# EAGLE design espIntrepid (EAGLE 9.6.2)
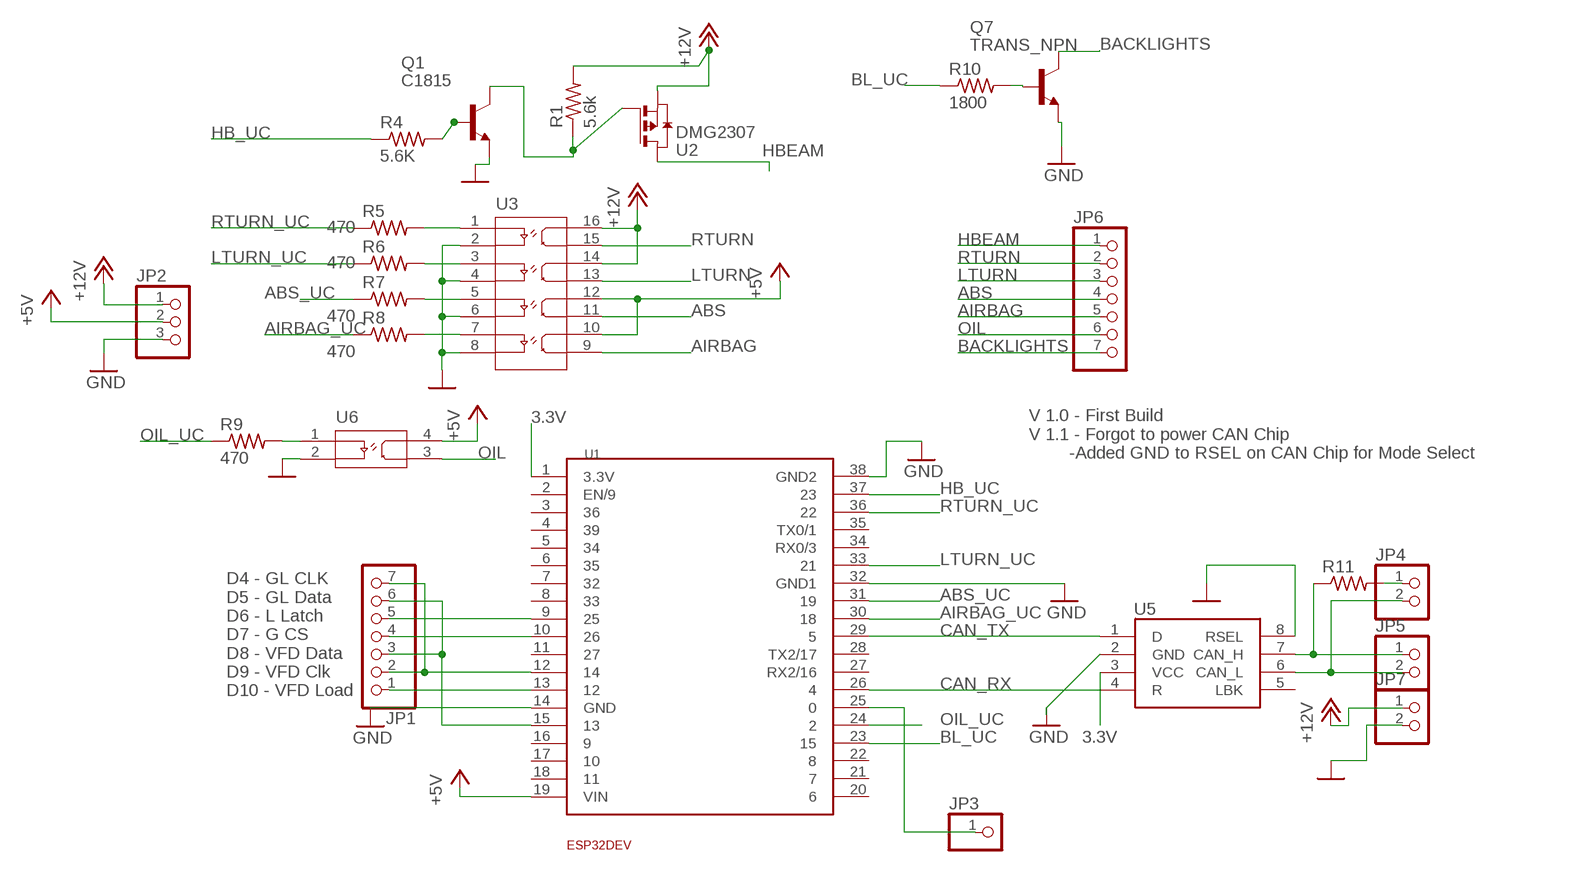
[diagram p0: schematic, sheet 1]

## Parts
JP1  PINHD-1X7  [1X07]
JP2  PINHD-1X3  [1X03]
JP3  PINHD-1X1  [1X01]
JP4  PINHD-1X2  [1X02]
JP5  PINHD-1X2  [1X02]
JP6  PINHD-1X7  [1X07]
JP7  PINHD-1X2  [1X02]
Q1  C1815  TRANS_NPN  [SOT-23]
Q7  TRANS_NPN  [SOT-23]
R1  5.6k  R-US_M1206  [M1206]
R4  5.6K  R-US_M1206  [M1206]
R5  470  R-US_M1206  [M1206]
R6  470  R-US_M1206  [M1206]
R7  470  R-US_M1206  [M1206]
R8  470  R-US_M1206  [M1206]
R9  470  R-US_M1206  [M1206]
R10  1800  R-US_M1206  [M1206]
R11  R-US_M1206  [M1206]
U1  ESP32DEV_38  [ESP32DEV_38]
U2  DMG2307  MOSFET_P  [SOT-23]
U3  LTV-847  [SM-16]
U5  SN65HVD233D  [SOIC-8]
U6  LTV-817  [SM-4]

## Nets
3.3V: U1.1(3.3V) U5.3(VCC)
+5V: JP2.2 U1.19(VIN) U3.10 U3.12 U6.4
+12V: JP2.1 JP7.1 R1.2 U2.2(S) U3.14 U3.16
ABS: JP6.4 U3.11
ABS_UC: R7.1 U1.31
AIRBAG: JP6.5 U3.9
AIRBAG_UC: R8.1 U1.30
BACKLIGHTS: JP6.7 Q7.3(C)
BL_UC: R10.1 U1.23
CAN_RX: U1.26 U5.4(R)
CAN_TX: U1.29 U5.1(D)
GND: JP2.3 JP7.2 Q1.2(E) Q7.2(E) U1.14(GND) U1.32(GND1) U1.38(GND2) U3.2 U3.4 U3.6 U3.8 U5.2(GND) U5.8(RSEL) U6.2
HB_UC: R4.1 U1.37
HBEAM: JP6.1 U2.3(D)
LTURN: JP6.3 U3.13
LTURN_UC: R6.1 U1.33
N$1: Q7.1(B) R10.2
N$2: R5.2 U3.1
N$3: JP5.1 R11.1 U5.7(CAN_H)
N$4: JP1.5 U1.9
N$5: JP1.4 U1.10
N$6: JP1.1 U1.13
N$7: JP1.3 JP1.6 U1.15
N$8: JP1.2 JP1.7 U1.12
N$11: R8.2 U3.7
N$12: Q1.1(B) R4.2
N$13: Q1.3(C) R1.1 U2.1(G)
N$14: R6.2 U3.3
N$15: R7.2 U3.5
N$16: R9.2 U6.1
N$17: JP3.1 U1.25
N$19: JP4.2 JP5.2 U5.6(CAN_L)
N$21: JP4.1 R11.2
OIL: JP6.6 U6.3
OIL_UC: R9.1 U1.24
RTURN: JP6.2 U3.15
RTURN_UC: R5.1 U1.36
Unconnected: U1.2(EN/9) U1.3 U1.4 U1.5 U1.6 U1.7 U1.8 U1.11 U1.16 U1.17 U1.18 U1.20 U1.21 U1.22 U1.27(RX2/16) U1.28(TX2/17) U1.34(RX0/3) U1.35(TX0/1) U5.5(LBK)

## Notes on the sheet
- V 1.0 - First Build
  V 1.1 - Forgot to power CAN Chip
          -Added GND to RSEL on CAN Chip for Mode Select
- D4 - GL CLK
  D5 - GL Data
  D6 - L Latch
  D7 - G CS
  D8 - VFD Data
  D9 - VFD Clk
  D10 - VFD Load

## Library data of the parts
JP1 JP6 = pinhead:PINHD-1X7: PIN HEADER
JP2 = pinhead:PINHD-1X3: PIN HEADER
JP3 = pinhead:PINHD-1X1: PIN HEADER
JP4 JP5 JP7 = pinhead:PINHD-1X2: PIN HEADER
Q1 Q7 = DR:TRANS_NPN: Transistor, NPN
R1 R4-R11 = DR:R-US_: RESISTOR, American symbol
U1 = DR:ESP32DEV_38
U2 = DR:MOSFET_P
U3 = DR:LTV-847: OptoIsolator
U5 = DR:SN65HVD233D: CAN Transceiver with loopback and mode sel
U6 = DR:LTV-817: Single OptoIsolator

## Board
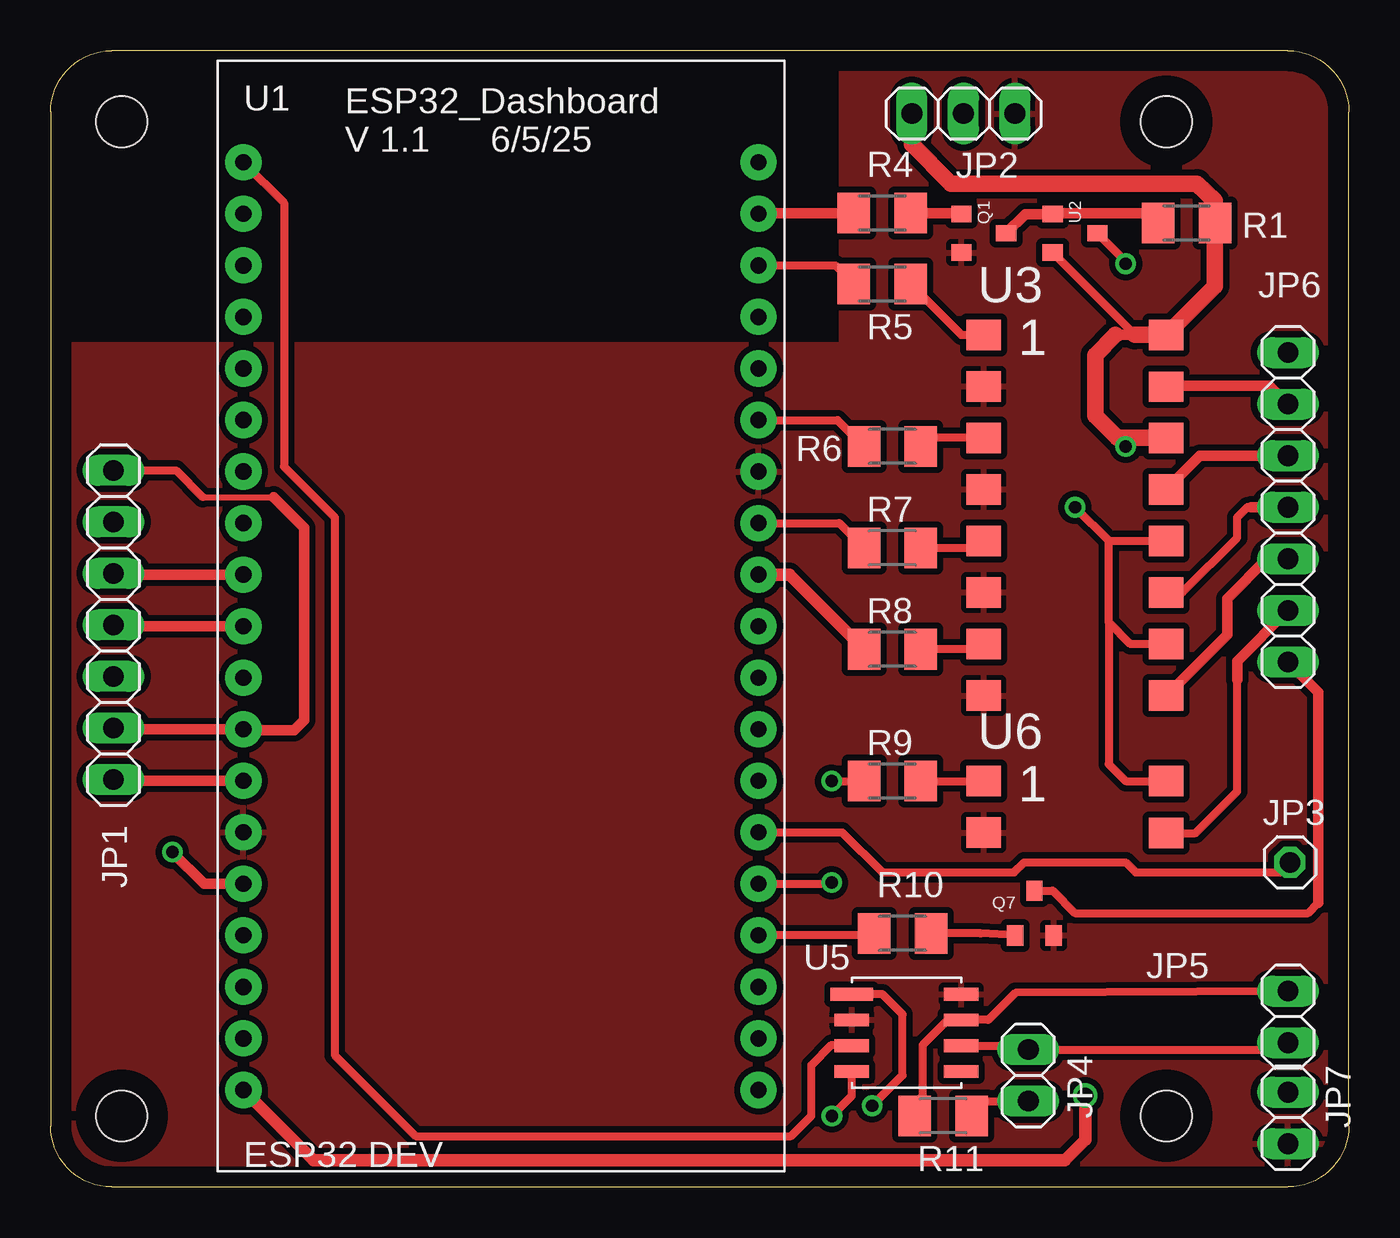
[diagram p1: board, top side]
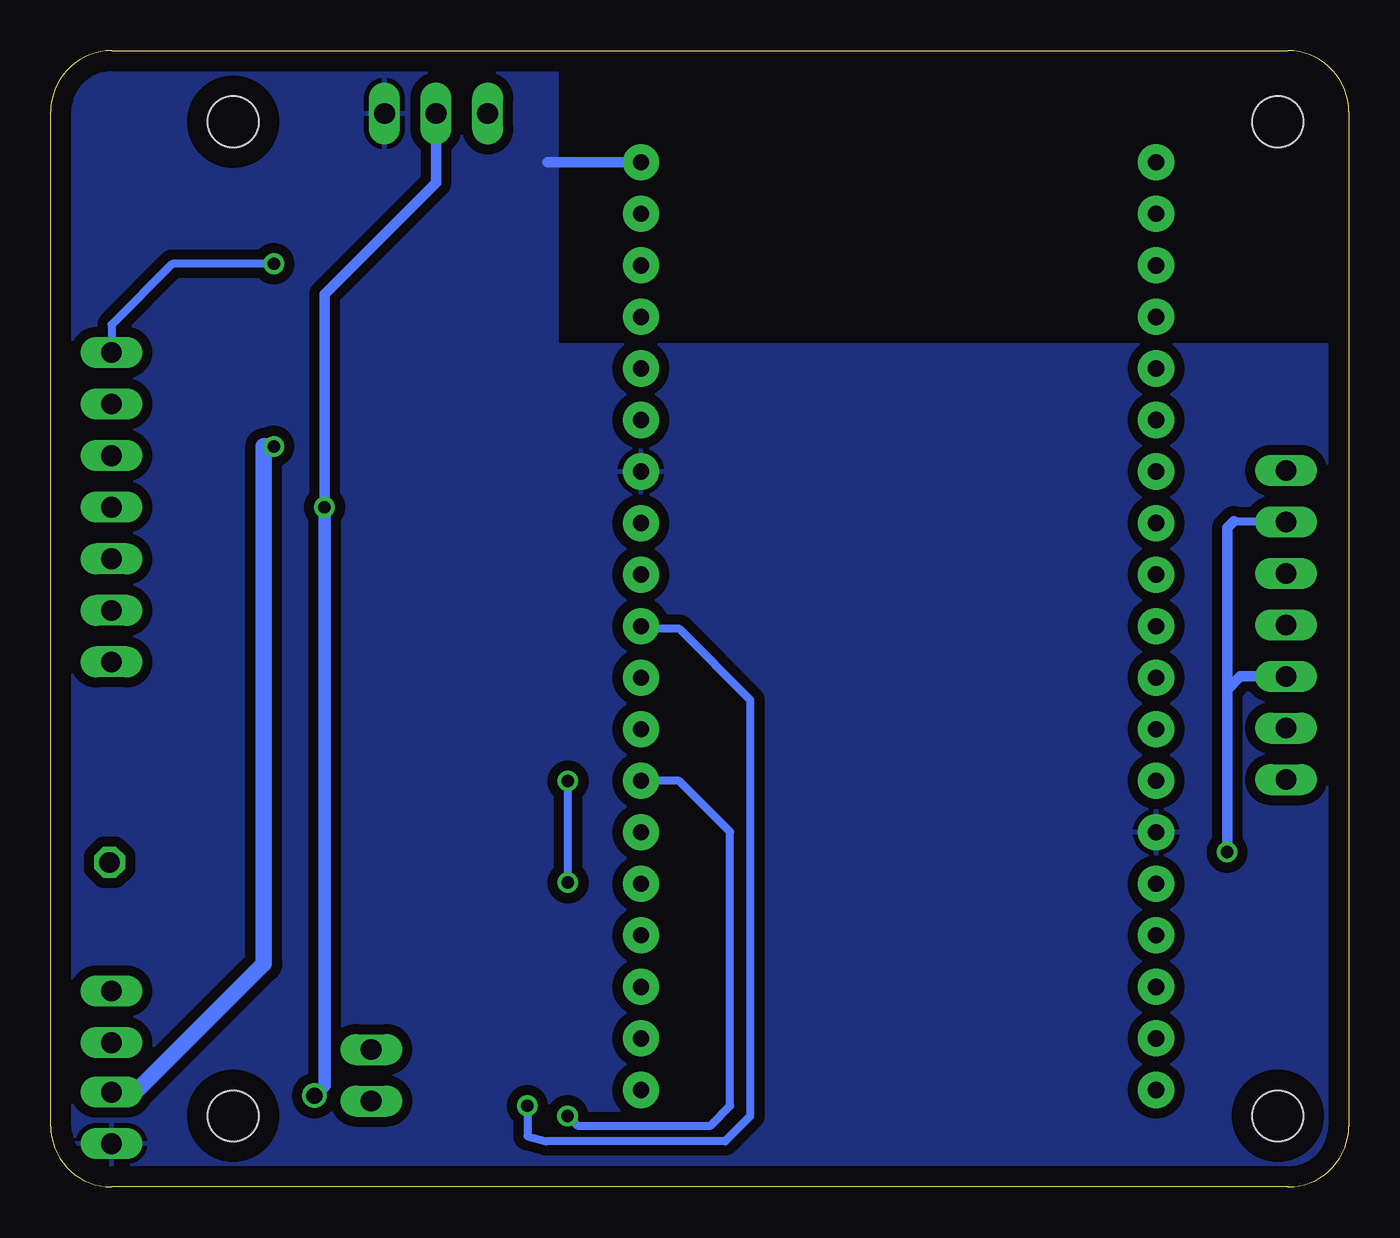
[diagram p2: board, bottom side, seen from below]

Size 64 x 56 mm. Coordinates in mm from the lower left corner, seen from the top.
Outline: 3,0 61,0 arc90 64,3 64,53 arc90 61,56 3,56 arc90 0,53 0,3 arc90 3,0
Copper layers (1*16): Top 0.035mm / dielectric 1.5mm / Bottom 0.035mm
Design rules "default": minimum track width 10mil, minimum drill 24mil, track to track 8mil, track to pad 8mil, pad to pad 8mil, via to via 8mil, smd to smd 8mil, copper to edge 40mil, drill to drill 8mil, minimum pad ring 10mil, minimum via ring 8mil, stop-mask expansion 4mil, vias tented up to drill 0mil, thermal gap 10mil
Holes 2.5 mm at 3.5,3.5 3.5,52.5 55,3.5 55,52.5

### Footprints (pad centres in the part's own frame; a part is rotated, then mirrored left to right if it is on the bottom)
1X07 = drill 1.016 long: 1 -7.62,0; 2 -5.08,0; 3 -2.54,0; 4 0,0; 5 2.54,0; 6 5.08,0; 7 7.62,0
1X03 = drill 1.016 long: 1 -2.54,0; 2 0,0; 3 2.54,0
1X01 = drill 1.016 octagon: 1 0,0
1X02 = drill 1.016 long: 1 -1.27,0; 2 1.27,0
SOT-23 = smd 0.8 x 1: 1 -0.95,-2.1; 2 0.95,-2.1; 3 0,0.1
M1206 = smd 1.6 x 2: 1 -1.4,0; 2 1.4,0
ESP32DEV_38 = drill 0.8 pad 1.778: 1 0,0; 2 0,-2.54; 3 0,-5.08; 4 0,-7.62; 5 0,-10.16; 6 0,-12.7; 7 0,-15.24; 8 0,-17.78; 9 0,-20.32; 10 0,-22.86; 11 0,-25.4; 12 0,-27.94; 13 0,-30.48; 14 0,-33.02; 15 0,-35.56; 16 0,-38.1; 17 0,-40.64; 18 0,-43.18; 19 0,-45.72; 20 25.4,-45.72; 21 25.4,-43.18; 22 25.4,-40.64; 23 25.4,-38.1; 24 25.4,-35.56; 25 25.4,-33.02; 26 25.4,-30.48; 27 25.4,-27.94; 28 25.4,-25.4; 29 25.4,-22.86; 30 25.4,-20.32; 31 25.4,-17.78; 32 25.4,-15.24; 33 25.4,-12.7; 34 25.4,-10.16; 35 25.4,-7.62; 36 25.4,-5.08; 37 25.4,-2.54; 38 25.4,0
SM-16 = smd 1.7 x 1.5: 1 0,0; 2 0,-2.54; 3 0,-5.08; 4 0,-7.62; 5 0,-10.16; 6 0,-12.7; 7 0,-15.24; 8 0,-17.78; 9 9,-17.78; 10 9,-15.24; 11 9,-12.7; 12 9,-10.16; 13 9,-7.62; 14 9,-5.08; 15 9,-2.56; 16 9,0
SOIC-8 = smd 2.1 x 0.635: 1 0,0 | smd 1.7 x 0.635: 2 0,-1.27; 3 0,-2.54; 4 0,-3.81; 5 5.4,-3.81; 6 5.4,-2.54; 7 5.4,-1.27; 8 5.4,0
SM-4 = smd 1.7 x 1.5: 1 0,0; 2 0,-2.54; 3 9,-2.56; 4 9,0

### Placement (x,y rotation side)
JP1  3.1,27.7 90 top
JP2  45,52.9 0 top
JP3  61.1,16 0 top
JP4  48.2,5.5 90 top
JP5  61,8.38 270 top
JP6  61,33.5 270 top
JP7  61,3.4 270 top
Q1  47,47 270 top
Q7  48.5,14.5 0 top
R1  56,47.5 0 top
R4  41,48 0 top
R5  41,44.5 0 top
R6  41.5,36.5 0 top
R7  41.5,31.5 0 top
R8  41.5,26.5 0 top
R9  41.5,20 0 top
R10  42,12.5 0 top
R11  44,3.5 0 top
U1  9.5,50.5 0 top
U2  51.5,47 270 top
U3  46,42 0 top
U5  39.5,9.5 0 top
U6  46,20 0 top

### Tracks (layer width: path | path; a pad name or v marks a point on that pad's centre or on a via)
3.3V
  Top 0.406: U1.1 11.5,48.5 11.5,35.5 14,33 14,6.5 18,2.5 36.5,2.5 37.5,3.5 37.5,6 38.5,7 39.46,7 U5.3
+5V  (via drill 0.61, 0.8)
  Top 0.406: v50.5,33.5 52.16,31.84 | 52.16,31.84 U3.12 | U3.10 53.24,26.76 52.16,27.84 | 52.16,27.84 52.16,31.84 | U6.4 53,20 52.16,20.84 52.16,27.84
  Top 0.61: U1.19 12.96,1.32 50,1.32 51,2.32 v51,4.5
  Bottom 0.508: v50.5,33.5 50.5,44 45,49.5 JP2.2
  Bottom 0.61: v50.5,33.5 50.5,5 v51,4.5
+12V  (via drill 0.61)
  Top 0.406: 53.45,42 U2.2
  Top 0.508: 52.5,42 U3.16 | 57.4,48.6 R1.2
  Top 0.813: U3.14 53,36.92 | 53,36.92 52.58,36.92 51.5,38 51.5,41 52.5,42 | JP2.1 42.46,51.38 44.38,49.45 56.52,49.45 57.4,48.6 | R1.2 57.4,44.4 U3.16 53.45,42 | v53,36.5 53,36.92
  Bottom 0.813: JP7.1 59.93,4.57 53.5,11 53.5,36.5 v53,36.5
ABS
  Top 0.406: U3.11 55.8,29.3 58.5,32 58.5,33 59,33.5 59.2,33.5
  Top 0.508: 59.2,33.5 JP6.4
ABS_UC
  Top 0.406: U1.31 38.88,32.72 R7.1
AIRBAG
  Top 0.508: U3.9 58,27.22 58,29 60,31 60.96,31 JP6.5
AIRBAG_UC
  Top 0.61: U1.30 36.42,30.18 R8.1
BACKLIGHTS
  Top 0.406: Q7.3 49.4,14.6 50.5,13.5 62,13.5 62.5,14
  Top 0.508: JP6.7 62.5,24.38 62.5,14
BL_UC
  Top 0.406: R10.1 40.5,12.4 U1.23
CAN_RX  (via drill 0.61)
  Top 0.406: v38.52,3.5 39.5,4.48 U5.4
  Bottom 0.406: U1.26 33.02,20.02 30.5,17.5 30.5,4 31.5,3 38,3 38.5,3.5 v38.52,3.5
CAN_TX  (via drill 0.61)
  Top 0.406: v40.5,4 42,5.5 42,8.5 41,9.5 U5.1
  Bottom 0.406: U1.29 34.76,27.5 33,27.5 29.5,24 29.5,3.5 30.75,2.25 39.57,2.25 40.5,2.5 v40.5,4
GND
  Bottom 0.508: U1.38 39.5,50.5
  pour Bottom (isolate 0.5): -0.5,41.5 39,41.5 39,56.5 65.5,56.5 65.5,-1 -0.5,-1
  pour Top (isolate 0.305): -0.5,-0.5 -0.5,41.5 39,41.5 39,57 64.5,57 64.5,-0.5
HB_UC
  Top 0.508: U1.37 34.94,48 R4.1
HBEAM  (via drill 0.61)
  Top 0.406: U2.3 53,45.6 v53,45.5
  Bottom 0.406: v53,45.5 58,45.5 61,42.5 JP6.1
LTURN
  Top 0.508: U3.13 56.66,36.04 JP6.3
LTURN_UC
  Top 0.406: U1.33 38.8,37.8 R6.1
N$1
  Top 0.406: Q7.1 45.85,12.5 R10.2
N$2
  Top 0.406: R5.2 44.9,42 U3.1
N$3
  Top 0.406: R11.1 42.6,4.1 43,4.5 43,7 44.23,8.23 U5.7 46.23,8.23 47.57,9.57 JP5.1
N$4
  Top 0.508: U1.9 3.16,30.18 JP1.5
N$5
  Top 0.508: U1.10 3.16,27.64 JP1.4
N$6
  Top 0.508: U1.13 3.16,20.02 JP1.1
N$7  (via drill 0.61)
  Top 0.508: U1.15 7.56,14.94 v6,16.5
  Bottom 0.406: 5.68,32.82 3.14,32.82 JP1.6
  Bottom 0.508: v6,16.5 6,24.5 | JP1.3 5.34,25.16 6,24.5 | 5.68,32.82 6,32.5 6,24.5
N$8
  Top 0.305: 7.5,34 11,34
  Top 0.406: JP1.7 6.18,35.32 7.5,34
  Top 0.508: JP1.2 3.16,22.56 U1.12 9.56,22.5 12,22.5 12.5,23 12.5,32.5 11,34
N$11
  Top 0.406: U3.7 45.74,26.5 R8.2
N$12
  Top 0.508: R4.2 44.85,48 Q1.1
N$13
  Top 0.508: Q1.3 48.05,47.95 U2.1 49.45,48 54.5,48 54.6,47.9 R1.1
N$14
  Top 0.406: U3.3 43.32,36.92 R6.2
N$15
  Top 0.406: R7.2 45.66,31.5 U3.5
N$16
  Top 0.406: R9.2 U6.1
N$17
  Top 0.406: U1.25 39.02,17.48 41,15.5 47.5,15.5 48,16 53,16 53.5,15.5 60.6,15.5 JP3.1
N$19
  Top 0.406: U5.6 48.01,6.96 JP4.2 60.74,6.77 JP5.2
N$21
  Top 0.406: R11.2 46.13,4.23 JP4.1
OIL
  Top 0.406: U6.3 56.44,17.44 58.5,19.5 58.5,25
  Top 0.508: JP6.6 58.5,25.92 58.5,25
OIL_UC  (via drill 0.61)
  Top 0.406: U1.24 38.44,14.94 v38.5,15 | v38.5,20 R9.1
  Bottom 0.406: v38.5,15 v38.5,20
RTURN
  Top 0.508: U3.15 55.06,39.5 60.08,39.5 JP6.2
RTURN_UC
  Top 0.406: U1.36 38.68,45.42 R5.1

### Text on the board
tNames: ESP32_Dashboard / V 1.1 6/5/25